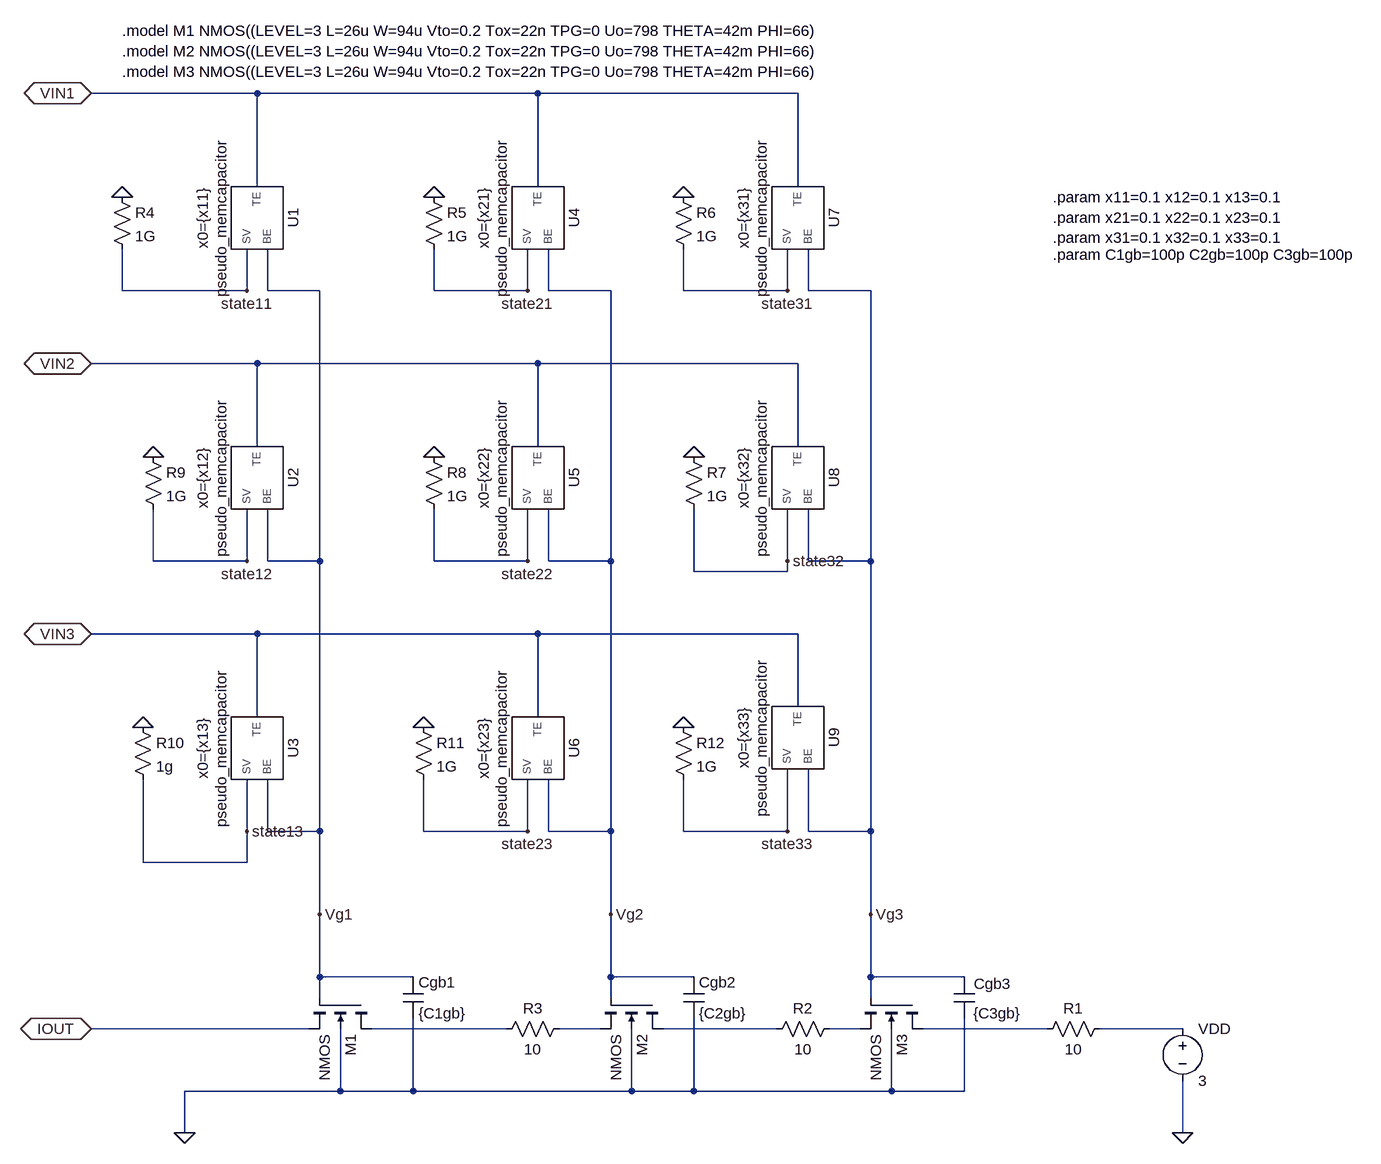
[diagram p0: schematic neuro_memristor_3x3.asc]
neuro_memristor_3x3.asc, the LTspice schematic file:
Version 4
SHEET 1 2604 1572
WIRE 864 -208 608 -208
WIRE 1296 -208 864 -208
WIRE 1696 -208 1296 -208
WIRE 864 -64 864 -208
WIRE 1296 -64 1296 -208
WIRE 1696 -64 1696 -208
WIRE 656 96 656 32
WIRE 848 96 848 32
WIRE 848 96 656 96
WIRE 880 96 880 32
WIRE 960 96 880 96
WIRE 1136 96 1136 32
WIRE 1280 96 1280 32
WIRE 1280 96 1136 96
WIRE 1312 96 1312 32
WIRE 1408 96 1312 96
WIRE 1520 96 1520 32
WIRE 1680 96 1680 32
WIRE 1680 96 1520 96
WIRE 1712 96 1712 32
WIRE 1808 96 1712 96
WIRE 864 208 608 208
WIRE 1296 208 864 208
WIRE 1696 208 1296 208
WIRE 864 336 864 208
WIRE 1296 336 1296 208
WIRE 1696 336 1696 208
WIRE 704 512 704 432
WIRE 848 512 848 432
WIRE 848 512 704 512
WIRE 880 512 880 432
WIRE 960 512 960 96
WIRE 960 512 880 512
WIRE 1136 512 1136 432
WIRE 1280 512 1280 432
WIRE 1280 512 1136 512
WIRE 1312 512 1312 432
WIRE 1408 512 1408 96
WIRE 1408 512 1312 512
WIRE 1680 512 1680 432
WIRE 1712 512 1712 432
WIRE 1808 512 1808 96
WIRE 1808 512 1712 512
WIRE 1536 528 1536 432
WIRE 1680 528 1680 512
WIRE 1680 528 1536 528
WIRE 864 624 608 624
WIRE 1296 624 864 624
WIRE 1696 624 1296 624
WIRE 1696 736 1696 624
WIRE 864 752 864 624
WIRE 1296 752 1296 624
WIRE 848 928 848 848
WIRE 880 928 880 848
WIRE 960 928 960 512
WIRE 960 928 880 928
WIRE 1120 928 1120 848
WIRE 1280 928 1280 848
WIRE 1280 928 1120 928
WIRE 1312 928 1312 848
WIRE 1408 928 1408 512
WIRE 1408 928 1312 928
WIRE 1520 928 1520 848
WIRE 1680 928 1680 832
WIRE 1680 928 1520 928
WIRE 1712 928 1712 832
WIRE 1808 928 1808 512
WIRE 1808 928 1712 928
WIRE 688 976 688 848
WIRE 848 976 848 928
WIRE 848 976 688 976
WIRE 960 1056 960 928
WIRE 1408 1056 1408 928
WIRE 1808 1056 1808 928
WIRE 960 1152 960 1056
WIRE 1104 1152 960 1152
WIRE 1408 1152 1408 1056
WIRE 1536 1152 1408 1152
WIRE 1808 1152 1808 1056
WIRE 1952 1152 1808 1152
WIRE 960 1184 960 1152
WIRE 1408 1184 1408 1152
WIRE 1808 1184 1808 1152
WIRE 944 1232 608 1232
WIRE 1248 1232 1040 1232
WIRE 1392 1232 1328 1232
WIRE 1664 1232 1488 1232
WIRE 1792 1232 1744 1232
WIRE 2080 1232 1888 1232
WIRE 2288 1232 2160 1232
WIRE 992 1328 992 1232
WIRE 992 1328 752 1328
WIRE 1104 1328 1104 1216
WIRE 1104 1328 992 1328
WIRE 1440 1328 1440 1232
WIRE 1440 1328 1104 1328
WIRE 1536 1328 1536 1216
WIRE 1536 1328 1440 1328
WIRE 1840 1328 1840 1232
WIRE 1840 1328 1536 1328
WIRE 1952 1328 1952 1216
WIRE 1952 1328 1840 1328
WIRE 752 1392 752 1328
WIRE 2288 1392 2288 1312
FLAG 2288 1392 0
FLAG 1808 1056 Vg3
FLAG 848 512 state12
FLAG 848 928 state13
FLAG 1408 1056 Vg2
FLAG 960 1056 Vg1
FLAG 1280 96 state21
FLAG 1280 512 state22
FLAG 1280 928 state23
FLAG 1680 96 state31
FLAG 1680 512 state32
FLAG 1680 928 state33
FLAG 752 1392 0
FLAG 608 -208 VIN1
IOPIN 608 -208 BiDir
FLAG 608 208 VIN2
IOPIN 608 208 BiDir
FLAG 608 624 VIN3
IOPIN 608 624 BiDir
FLAG 608 1232 IOUT
IOPIN 608 1232 BiDir
FLAG 848 96 state11
FLAG 656 -48 0
FLAG 1136 -48 0
FLAG 1520 -48 0
FLAG 1536 352 0
FLAG 1136 352 0
FLAG 704 352 0
FLAG 688 768 0
FLAG 1120 768 0
FLAG 1520 768 0
SYMBOL voltage 2288 1216 R0
SYMATTR InstName VDD
SYMATTR Value 3
SYMBOL nmos4 1888 1184 R90
SYMATTR InstName M3
SYMBOL cap 1936 1152 R0
WINDOW 0 31 11 Left 2
WINDOW 3 30 56 Left 2
SYMATTR InstName Cgb3
SYMATTR Value {C3gb}
SYMBOL pseudo_memcapacitor 864 384 R90
WINDOW 123 0 68 Top 2
SYMATTR Value2 x0={x12}
SYMATTR InstName U2
SYMBOL pseudo_memcapacitor 864 800 R90
WINDOW 123 0 68 Top 2
SYMATTR Value2 x0={x13}
SYMATTR InstName U3
SYMBOL pseudo_memcapacitor 1296 -16 R90
WINDOW 123 0 68 Top 2
SYMATTR Value2 x0={x21}
SYMATTR InstName U4
SYMBOL pseudo_memcapacitor 1296 384 R90
WINDOW 123 0 68 Top 2
SYMATTR Value2 x0={x22}
SYMATTR InstName U5
SYMBOL pseudo_memcapacitor 1296 800 R90
WINDOW 123 0 68 Top 2
SYMATTR Value2 x0={x23}
SYMATTR InstName U6
SYMBOL pseudo_memcapacitor 1696 -16 R90
WINDOW 123 0 68 Top 2
SYMATTR Value2 x0={x31}
SYMATTR InstName U7
SYMBOL pseudo_memcapacitor 1696 384 R90
WINDOW 123 0 68 Top 2
SYMATTR Value2 x0={x32}
SYMATTR InstName U8
SYMBOL pseudo_memcapacitor 1696 784 R90
WINDOW 123 0 68 Top 2
SYMATTR Value2 x0={x33}
SYMATTR InstName U9
SYMBOL nmos4 1488 1184 R90
SYMATTR InstName M2
SYMBOL nmos4 1040 1184 R90
SYMATTR InstName M1
SYMBOL cap 1520 1152 R0
SYMATTR InstName Cgb2
SYMATTR Value {C2gb}
SYMBOL cap 1088 1152 R0
SYMATTR InstName Cgb1
SYMATTR Value {C1gb}
SYMBOL res 2176 1216 R90
WINDOW 0 0 56 VBottom 2
WINDOW 3 32 56 VTop 2
SYMATTR InstName R1
SYMATTR Value 10
SYMBOL res 1760 1216 R90
WINDOW 0 0 56 VBottom 2
WINDOW 3 32 56 VTop 2
SYMATTR InstName R2
SYMATTR Value 10
SYMBOL res 1344 1216 R90
WINDOW 0 0 56 VBottom 2
WINDOW 3 32 56 VTop 2
SYMATTR InstName R3
SYMATTR Value 10
SYMBOL pseudo_memcapacitor 864 -16 R90
WINDOW 123 0 68 Top 2
SYMATTR Value2 x0={x11}
SYMATTR InstName U1
SYMBOL res 640 -64 R0
SYMATTR InstName R4
SYMATTR Value 1G
SYMBOL res 1120 -64 R0
SYMATTR InstName R5
SYMATTR Value 1G
SYMBOL res 1504 -64 R0
SYMATTR InstName R6
SYMATTR Value 1G
SYMBOL res 1520 336 R0
SYMATTR InstName R7
SYMATTR Value 1G
SYMBOL res 1120 336 R0
SYMATTR InstName R8
SYMATTR Value 1G
SYMBOL res 688 336 R0
SYMATTR InstName R9
SYMATTR Value 1G
SYMBOL res 672 752 R0
SYMATTR InstName R10
SYMATTR Value 1g
SYMBOL res 1104 752 R0
SYMATTR InstName R11
SYMATTR Value 1G
SYMBOL res 1504 752 R0
SYMATTR InstName R12
SYMATTR Value 1G
TEXT 656 -304 Left 2 !.model M1 NMOS((LEVEL=3 L=26u W=94u Vto=0.2 Tox=22n TPG=0 Uo=798 THETA=42m PHI=66)\n.model M2 NMOS((LEVEL=3 L=26u W=94u Vto=0.2 Tox=22n TPG=0 Uo=798 THETA=42m PHI=66)\n.model M3 NMOS((LEVEL=3 L=26u W=94u Vto=0.2 Tox=22n TPG=0 Uo=798 THETA=42m PHI=66)
TEXT 2088 -48 Left 2 !.param x11=0.1 x12=0.1 x13=0.1\n.param x21=0.1 x22=0.1 x23=0.1\n.param x31=0.1 x32=0.1 x33=0.1
TEXT 2088 40 Left 2 !.param C1gb=100p C2gb=100p C3gb=100p

The netlist it stands for:
* neuro_memristor_3x3.asc
VDD N006 0 3
M3 N005 Vg3 N004 0 NMOS
Cgb3 Vg3 0 {C3gb}
XU2 VIN2 Vg1 state12 pseudo_memcapacitor x0={x12}  ; pins TE BE SV
XU3 VIN3 Vg1 state13 pseudo_memcapacitor x0={x13}  ; pins TE BE SV
XU4 VIN1 Vg2 state21 pseudo_memcapacitor x0={x21}  ; pins TE BE SV
XU5 VIN2 Vg2 state22 pseudo_memcapacitor x0={x22}  ; pins TE BE SV
XU6 VIN3 Vg2 state23 pseudo_memcapacitor x0={x23}  ; pins TE BE SV
XU7 VIN1 Vg3 state31 pseudo_memcapacitor x0={x31}  ; pins TE BE SV
XU8 VIN2 Vg3 state32 pseudo_memcapacitor x0={x32}  ; pins TE BE SV
XU9 VIN3 Vg3 state33 pseudo_memcapacitor x0={x33}  ; pins TE BE SV
M2 N003 Vg2 N002 0 NMOS
M1 N001 Vg1 IOUT 0 NMOS
Cgb2 Vg2 0 {C2gb}
Cgb1 Vg1 0 {C1gb}
R1 N006 N005 10
R2 N004 N003 10
R3 N002 N001 10
XU1 VIN1 Vg1 state11 pseudo_memcapacitor x0={x11}  ; pins TE BE SV
R4 0 state11 1G
R5 0 state21 1G
R6 0 state31 1G
R7 0 state32 1G
R8 0 state22 1G
R9 0 state12 1G
R10 0 state13 1g
R11 0 state23 1G
R12 0 state33 1G
.model NMOS NMOS
.model PMOS PMOS
.lib standard.mos
.model M1 NMOS((LEVEL=3 L=26u W=94u Vto=0.2 Tox=22n TPG=0 Uo=798 THETA=42m PHI=66)
.model M2 NMOS((LEVEL=3 L=26u W=94u Vto=0.2 Tox=22n TPG=0 Uo=798 THETA=42m PHI=66)
.model M3 NMOS((LEVEL=3 L=26u W=94u Vto=0.2 Tox=22n TPG=0 Uo=798 THETA=42m PHI=66)
.param x11=0.1 x12=0.1 x13=0.1
.param x21=0.1 x22=0.1 x23=0.1
.param x31=0.1 x32=0.1 x33=0.1
.param C1gb=100p C2gb=100p C3gb=100p
.lib pseudo_memcapacitor.cir
.backanno
.end